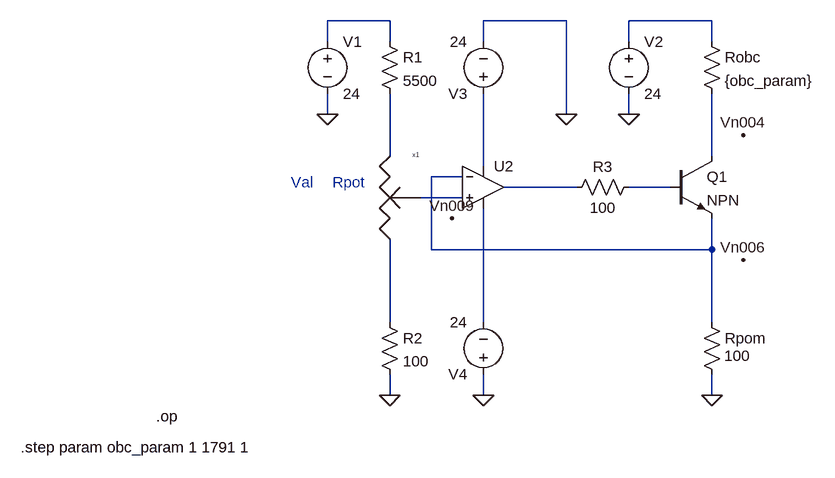
[diagram p0: schematic przykladNPN.asc]
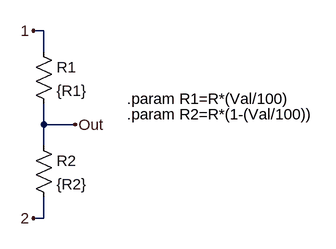
[diagram p1: sub-circuit potentiometer.asc]
przykladNPN.asc, the LTspice schematic file:
Version 4
SHEET 1 1040 680
WIRE 128 -48 32 -48
WIRE 400 -48 272 -48
WIRE 624 -48 496 -48
WIRE 32 -16 32 -48
WIRE 128 -16 128 -48
WIRE 272 -16 272 -48
WIRE 496 -16 496 -48
WIRE 624 -16 624 -48
WIRE 32 96 32 64
WIRE 400 96 400 -48
WIRE 496 96 496 64
WIRE 128 160 128 64
WIRE 624 160 624 64
WIRE 272 176 272 64
WIRE 240 192 192 192
WIRE 416 208 304 208
WIRE 560 208 496 208
WIRE 240 224 176 224
WIRE 192 304 192 192
WIRE 624 304 624 256
WIRE 624 304 192 304
WIRE 128 416 128 288
WIRE 272 416 272 240
WIRE 624 416 624 304
WIRE 128 528 128 496
WIRE 272 528 272 496
WIRE 624 528 624 496
FLAG 128 528 0
FLAG 624 528 0
FLAG 32 96 0
FLAG 496 96 0
FLAG 400 96 0
FLAG 272 528 0
FLAG 224 256 Vn009
FLAG 672 320 Vn006
FLAG 672 128 Vn004
SYMBOL res 112 -32 R0
SYMATTR InstName R1
SYMATTR Value 5500
SYMBOL res 112 400 R0
SYMATTR InstName R2
SYMATTR Value 100
SYMBOL res 512 192 R90
WINDOW 0 0 56 VBottom 2
WINDOW 3 32 56 VTop 2
SYMATTR InstName R3
SYMATTR Value 100
SYMBOL npn 560 160 R0
SYMATTR InstName Q1
SYMBOL res 608 400 R0
WINDOW 3 35 67 Left 2
SYMATTR Value 100
SYMATTR InstName Rpom
SYMBOL res 608 -32 R0
SYMATTR InstName Robc
SYMATTR Value {obc_param}
SYMBOL voltage 32 -32 R0
WINDOW 123 0 0 Left 0
WINDOW 39 0 0 Left 0
SYMATTR InstName V1
SYMATTR Value 24
SYMBOL Potentiometer 128 224 R0
SYMATTR InstName x1
SYMATTR SpiceLine R=400,Val=100
SYMBOL voltage 496 -32 R0
WINDOW 123 0 0 Left 0
WINDOW 39 0 0 Left 0
SYMATTR InstName V2
SYMATTR Value 24
SYMBOL voltage 272 80 R180
WINDOW 123 0 0 Left 0
WINDOW 39 0 0 Left 0
SYMATTR InstName V3
SYMATTR Value 24
SYMBOL voltage 272 512 R180
WINDOW 123 0 0 Left 0
WINDOW 39 0 0 Left 0
SYMATTR InstName V4
SYMATTR Value 24
SYMBOL Opamps\\UniversalOpamp2 272 208 R0
SYMATTR InstName U2
TEXT 40 200 Left 2 ;Rpot
TEXT -232 560 Left 2 !.op
TEXT -440 608 Left 2 !.step param obc_param 1 1791 1
TEXT -24 200 Left 2 ;Val

potentiometer.asc, the sub-circuit schematic file:
Version 4
SHEET 1 880 680
WIRE 144 16 128 16
WIRE 144 48 144 16
WIRE 144 160 144 128
WIRE 192 160 144 160
WIRE 144 192 144 160
WIRE 144 304 144 272
WIRE 144 304 128 304
FLAG 128 16 1
FLAG 128 304 2
FLAG 192 160 Out
SYMBOL res 128 32 R0
SYMATTR InstName R1
SYMATTR Value {R1}
SYMBOL res 128 176 R0
SYMATTR InstName R2
SYMATTR Value {R2}
TEXT 272 120 Left 2 !.param R1=R*(Val/100)
TEXT 272 144 Left 2 !.param R2=R*(1-(Val/100))

The netlist it stands for:
* przykladNPN.asc
R1 N001 N003 5500
R2 N010 0 100
R3 N008 N007 100
Q1 N004 N008 N006 0 NPN
Rpom N006 0 100
Robc N002 N004 {obc_param}
V1 N001 0 24
Xx1 N003 N010 N009 potentiometer params: R=400,Val=100
V2 N002 0 24
V3 N005 0 24
V4 0 N011 24
XU2 N009 N006 N005 N011 N007 level.2 Avol=1Meg GBW=10Meg Slew=10Meg ilimit=25m rail=0 Vos=0 phimargin=45 en=0 enk=0 in=0 ink=0 Rin=500Meg  ; pins IN+ IN- V+ V- OUT

* block symbol definitions
.subckt potentiometer 1 2 Out
R1 1 Out {R1}
R2 Out 2 {R2}
.param R1=R*(Val/100)
.param R2=R*(1-(Val/100))
.ends potentiometer

.model NPN NPN
.model PNP PNP
.lib standard.bjt
* Rpot
.op
.step param obc_param 1 1791 1
* Val
.lib UniversalOpamps2.sub
.backanno
.end